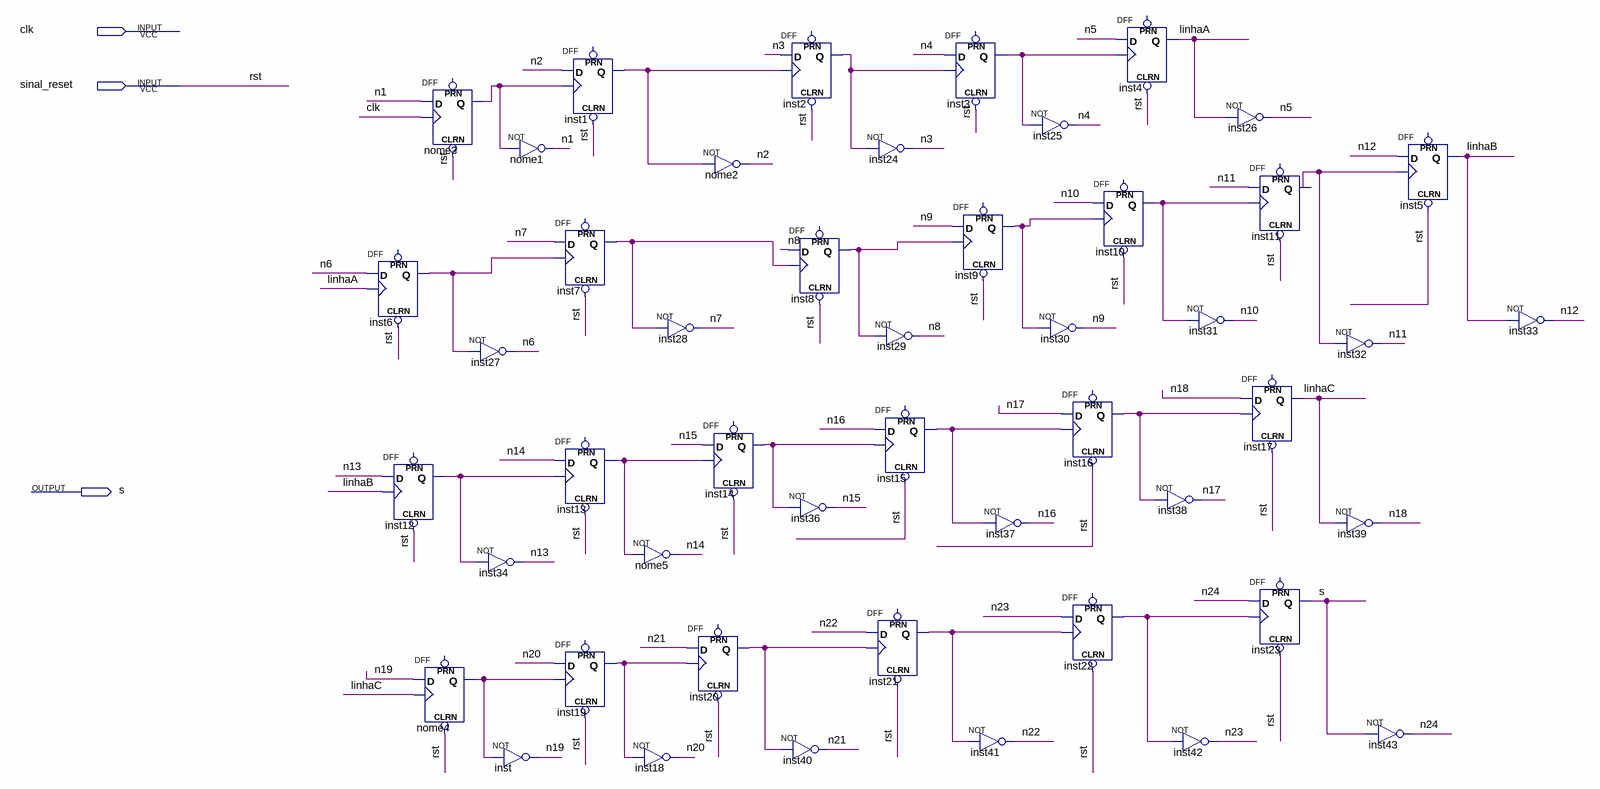
[diagram p0: schematic sheet]
// Quartus schematic Divisor_Frequencia.bdf as structural Verilog: 48 symbols, 3 pins
module Divisor_Frequencia (
  input  clk,
  input  sinal_reset,
  output s
);

  wire inst1_q, inst2_q, inst3_q, inst6_q, inst7_q, inst8_q, inst9_q, inst10_q, inst11_q, inst12_q, inst13_q,
       inst14_q, inst15_q, inst16_q, inst19_q, inst20_q, inst21_q, inst22_q, linhaA, linhaB, linhaC, n1, n2,
       n3, n4, n5, n6, n7, n8, n9, n10, n11, n12, n13, n14, n15, n16, n17, n18, n19, n20, n21, n22, n23, n24,
       nome3_q, nome4_q;

  DFF inst6 (.CLRN(sinal_reset), .CLK(linhaA), .D(n6), .Q(inst6_q));  // open: PRN
  DFF inst12 (.CLRN(sinal_reset), .CLK(linhaB), .D(n13), .Q(inst12_q));  // open: PRN
  DFF nome4 (.CLRN(sinal_reset), .CLK(linhaC), .D(n19), .Q(nome4_q));  // open: PRN
  DFF nome3 (.CLRN(sinal_reset), .CLK(clk), .D(n1), .Q(nome3_q));  // open: PRN
  not inst27 (n6, inst6_q);
  not inst34 (n13, inst12_q);
  not nome1 (n1, nome3_q);
  not inst (n19, nome4_q);
  DFF inst1 (.CLRN(sinal_reset), .CLK(nome3_q), .D(n2), .Q(inst1_q));  // open: PRN
  DFF inst7 (.CLRN(sinal_reset), .CLK(inst6_q), .D(n7), .Q(inst7_q));  // open: PRN
  DFF inst13 (.CLRN(sinal_reset), .CLK(inst12_q), .D(n14), .Q(inst13_q));  // open: PRN
  DFF inst19 (.CLRN(sinal_reset), .CLK(nome4_q), .D(n20), .Q(inst19_q));  // open: PRN
  not inst28 (n7, inst7_q);
  not nome5 (n14, inst13_q);
  not inst18 (n20, inst19_q);
  not nome2 (n2, inst1_q);
  DFF inst14 (.CLRN(sinal_reset), .CLK(inst13_q), .D(n15), .Q(inst14_q));  // open: PRN
  DFF inst20 (.CLRN(sinal_reset), .CLK(inst19_q), .D(n21), .Q(inst20_q));  // open: PRN
  DFF inst2 (.CLRN(sinal_reset), .CLK(inst1_q), .D(n3), .Q(inst2_q));  // open: PRN
  DFF inst8 (.CLRN(sinal_reset), .CLK(inst7_q), .D(n8), .Q(inst8_q));  // open: PRN
  not inst36 (n15, inst14_q);
  not inst40 (n21, inst20_q);
  not inst24 (n3, inst2_q);
  not inst29 (n8, inst8_q);
  DFF inst15 (.CLRN(sinal_reset), .CLK(inst14_q), .D(n16), .Q(inst15_q));  // open: PRN
  DFF inst21 (.CLRN(sinal_reset), .CLK(inst20_q), .D(n22), .Q(inst21_q));  // open: PRN
  DFF inst3 (.CLRN(sinal_reset), .CLK(inst2_q), .D(n4), .Q(inst3_q));  // open: PRN
  DFF inst9 (.CLRN(sinal_reset), .CLK(inst8_q), .D(n9), .Q(inst9_q));  // open: PRN
  not inst41 (n22, inst21_q);
  not inst25 (n4, inst3_q);
  not inst30 (n9, inst9_q);
  not inst37 (n16, inst15_q);
  DFF inst10 (.CLRN(sinal_reset), .CLK(inst9_q), .D(n10), .Q(inst10_q));  // open: PRN
  DFF inst16 (.CLRN(sinal_reset), .CLK(inst15_q), .D(n17), .Q(inst16_q));  // open: PRN
  DFF inst22 (.CLRN(sinal_reset), .CLK(inst21_q), .D(n23), .Q(inst22_q));  // open: PRN
  DFF inst4 (.CLRN(sinal_reset), .CLK(inst3_q), .D(n5), .Q(linhaA));  // open: PRN
  not inst38 (n17, inst16_q);
  not inst26 (n5, linhaA);
  not inst31 (n10, inst10_q);
  not inst42 (n23, inst22_q);
  DFF inst11 (.CLRN(sinal_reset), .CLK(inst10_q), .D(n11), .Q(inst11_q));  // open: PRN
  DFF inst17 (.CLRN(sinal_reset), .CLK(inst16_q), .D(n18), .Q(linhaC));  // open: PRN
  DFF inst23 (.CLRN(sinal_reset), .CLK(inst22_q), .D(n24), .Q(s));  // open: PRN
  not inst32 (n11, inst11_q);
  not inst39 (n18, linhaC);
  DFF inst5 (.CLRN(sinal_reset), .CLK(inst11_q), .D(n12), .Q(linhaB));  // open: PRN
  not inst43 (n24, s);
  not inst33 (n12, linhaB);

  // Other names for the same wires on the sheet: rst = sinal_reset
endmodule
